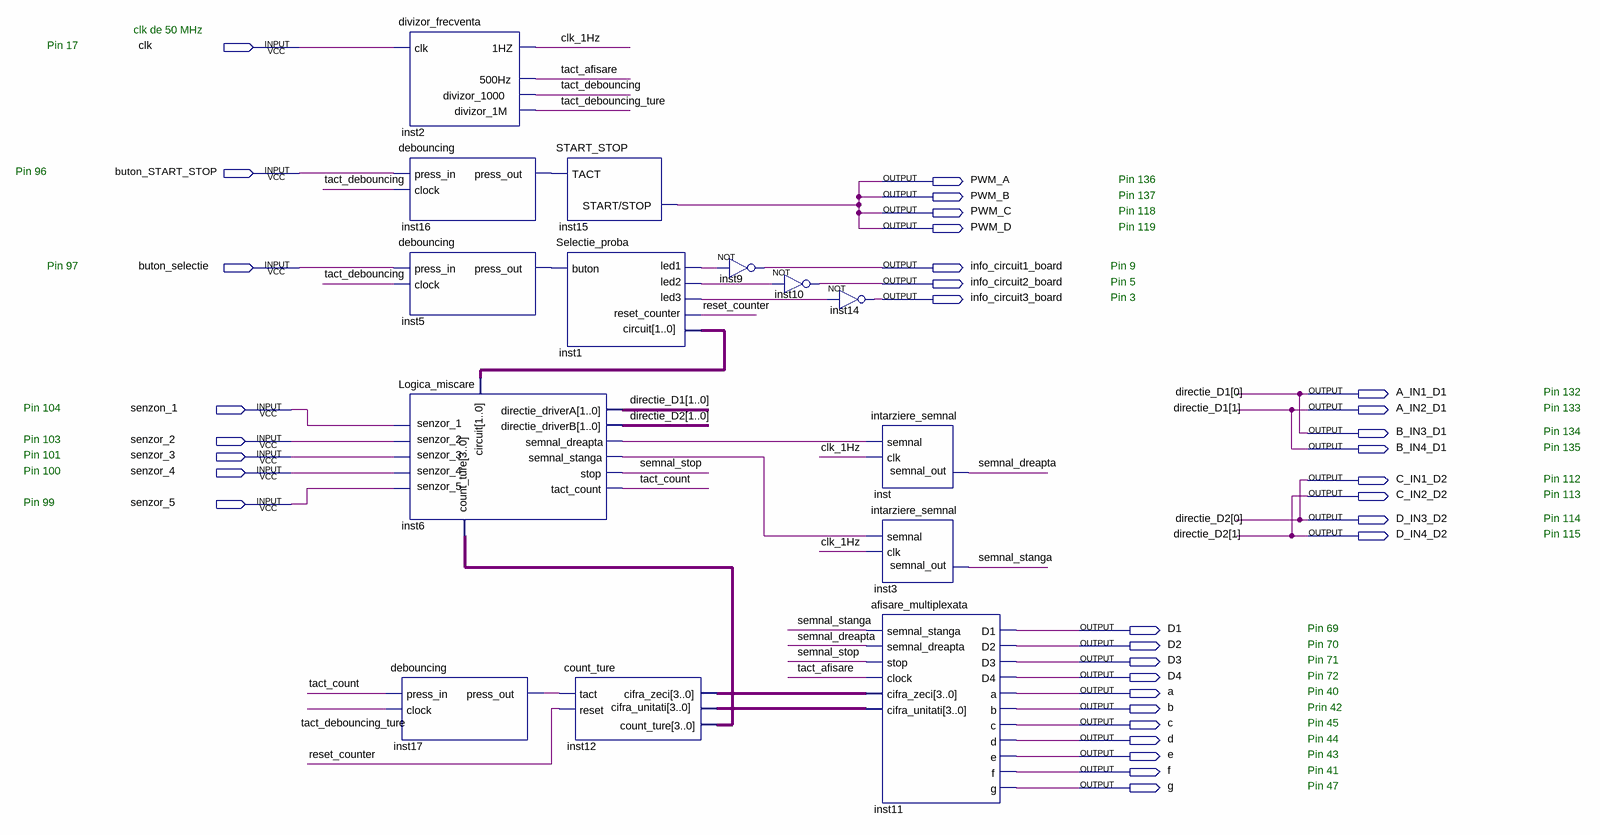
[diagram p0: schematic sheet]
// Quartus schematic main.bdf as structural Verilog: 14 symbols, 34 pins
module main (
  input  clk,
  input  buton_START_STOP,
  input  buton_selectie,
  input  senzon_1,
  input  senzor_2,
  input  senzor_3,
  input  senzor_4,
  input  senzor_5,
  output PWM_A,
  output PWM_B,
  output PWM_C,
  output PWM_D,
  output info_circuit1_board,
  output info_circuit2_board,
  output info_circuit3_board,
  output A_IN1_D1,
  output A_IN2_D1,
  output B_IN3_D1,
  output B_IN4_D1,
  output C_IN1_D2,
  output C_IN2_D2,
  output D_IN3_D2,
  output D_IN4_D2,
  output D1,
  output D2,
  output D3,
  output D4,
  output a,
  output b,
  output c,
  output d,
  output e,
  output f,
  output g
);

  wire clk_1Hz, inst1_led1, inst1_led2, inst1_led3, inst5_press_out, inst6_semnal_dreapta,
       inst6_semnal_stanga, inst16_press_out, inst17_press_out, reset_counter, semnal_dreapta, semnal_stanga,
       semnal_stop, tact_afisare, tact_count, tact_debouncing, tact_debouncing_ture;
  wire [1:0] inst1_circuit;
  wire [3:0] inst12_cifra_unitati, inst12_cifra_zeci, inst12_count_ture;

  divizor_frecventa inst2 (
    .clk(clk), .\500Hz (tact_afisare), .\1HZ (clk_1Hz), .divizor_1M(tact_debouncing_ture),
    .divizor_1000(tact_debouncing));
  debouncing inst16 (.press_in(buton_START_STOP), .clock(tact_debouncing), .press_out(inst16_press_out));
  debouncing inst5 (.press_in(buton_selectie), .clock(tact_debouncing), .press_out(inst5_press_out));
  Logica_miscare inst6 (
    .senzor_1(senzon_1), .senzor_2(senzor_2), .senzor_3(senzor_3), .senzor_4(senzor_4), .senzor_5(senzor_5),
    .circuit(inst1_circuit), .count_ture(inst12_count_ture), .directie_driverA({A_IN2_D1, A_IN1_D1}),
    .directie_driverB({C_IN2_D2, C_IN1_D2}), .semnal_dreapta(inst6_semnal_dreapta),
    .semnal_stanga(inst6_semnal_stanga), .stop(semnal_stop), .tact_count(tact_count));
  debouncing inst17 (.press_in(tact_count), .clock(tact_debouncing_ture), .press_out(inst17_press_out));
  START_STOP inst15 (.TACT(inst16_press_out), .\START/STOP (PWM_A));
  Selectie_proba inst1 (
    .buton(inst5_press_out), .circuit(inst1_circuit), .led1(inst1_led1), .led2(inst1_led2),
    .led3(inst1_led3), .reset_counter(reset_counter));
  count_ture inst12 (
    .tact(inst17_press_out), .reset(reset_counter), .cifra_unitati(inst12_cifra_unitati),
    .cifra_zeci(inst12_cifra_zeci), .count_ture(inst12_count_ture));
  not inst9 (info_circuit1_board, inst1_led1);
  not inst10 (info_circuit2_board, inst1_led2);
  not inst14 (info_circuit3_board, inst1_led3);
  intarziere_semnal inst (.semnal(inst6_semnal_dreapta), .clk(clk_1Hz), .semnal_out(semnal_dreapta));
  intarziere_semnal inst3 (.semnal(inst6_semnal_stanga), .clk(clk_1Hz), .semnal_out(semnal_stanga));
  afisare_multiplexata inst11 (
    .semnal_stanga(semnal_stanga), .semnal_dreapta(semnal_dreapta), .stop(semnal_stop), .clock(tact_afisare),
    .cifra_zeci(inst12_cifra_zeci), .cifra_unitati(inst12_cifra_unitati), .D1(D1), .D2(D2), .D3(D3), .D4(D4),
    .a(a), .b(b), .c(c), .d(d), .e(e), .f(f), .g(g));

  assign B_IN3_D1 = A_IN1_D1;
  assign B_IN4_D1 = A_IN2_D1;
  assign D_IN3_D2 = C_IN1_D2;
  assign D_IN4_D2 = C_IN2_D2;
  assign PWM_B = PWM_A;
  assign PWM_C = PWM_A;
  assign PWM_D = PWM_A;

  // Other names for the same wires on the sheet: directie_D1[1:0] = {A_IN2_D1, A_IN1_D1};
  //   directie_D2[1:0] = {C_IN2_D2, C_IN1_D2}

  // Notes on the sheet:
  //   clk de 50 MHz
  //   Pin 17
  //   Pin 96
  //   Pin 136
  //   Pin 137
  //   Pin 118
  //   Pin 119
  //   Pin 97
  //   Pin 9
  //   Pin 5
  //   Pin 3
  //   Pin 132
  //   Pin 104
  //   Pin 133
  //   Pin 134
  //   Pin 103
  //   Pin 135
  //   Pin 101
  //   Pin 100
  //   Pin 112
  //   Pin 113
  //   Pin 99
  //   Pin 114
  //   Pin 115
  //   Pin 69
  //   Pin 70
  //   Pin 71
  //   Pin 72
  //   Pin 40
  //   Prin 42
  //   Pin 45
  //   Pin 44
  //   Pin 43
  //   Pin 41
  //   Pin 47
endmodule
